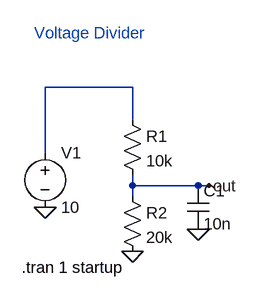
[diagram p0: schematic voltageDivider.asc]
voltageDivider.asc, the LTspice schematic file:
Version 4
SHEET 1 880 680
WIRE 96 32 -32 32
WIRE 96 80 96 32
WIRE -32 128 -32 32
WIRE 96 176 96 160
WIRE 192 176 96 176
WIRE 208 176 192 176
WIRE 96 192 96 176
FLAG 96 272 0
FLAG -32 208 0
FLAG 208 176 out
FLAG 192 240 0
SYMBOL res 80 64 R0
SYMATTR InstName R1
SYMATTR Value 10k
SYMBOL res 80 176 R0
SYMATTR InstName R2
SYMATTR Value 20k
SYMBOL voltage -32 112 R0
WINDOW 123 0 0 Left 0
WINDOW 39 0 0 Left 0
SYMATTR InstName V1
SYMATTR Value 10
SYMBOL cap 176 176 R0
SYMATTR InstName C1
SYMATTR Value 10n
TEXT -48 -48 Left 2 ;Voltage Divider
TEXT -66 296 Left 2 !.tran 1 startup

The netlist it stands for:
* voltageDivider.asc
R1 N001 out 10k
R2 out 0 20k
V1 N001 0 10
C1 out 0 10n
* Voltage Divider
.tran 1 startup
.backanno
.end